# EAGLE design rn4020 (EAGLE 7.3.0)
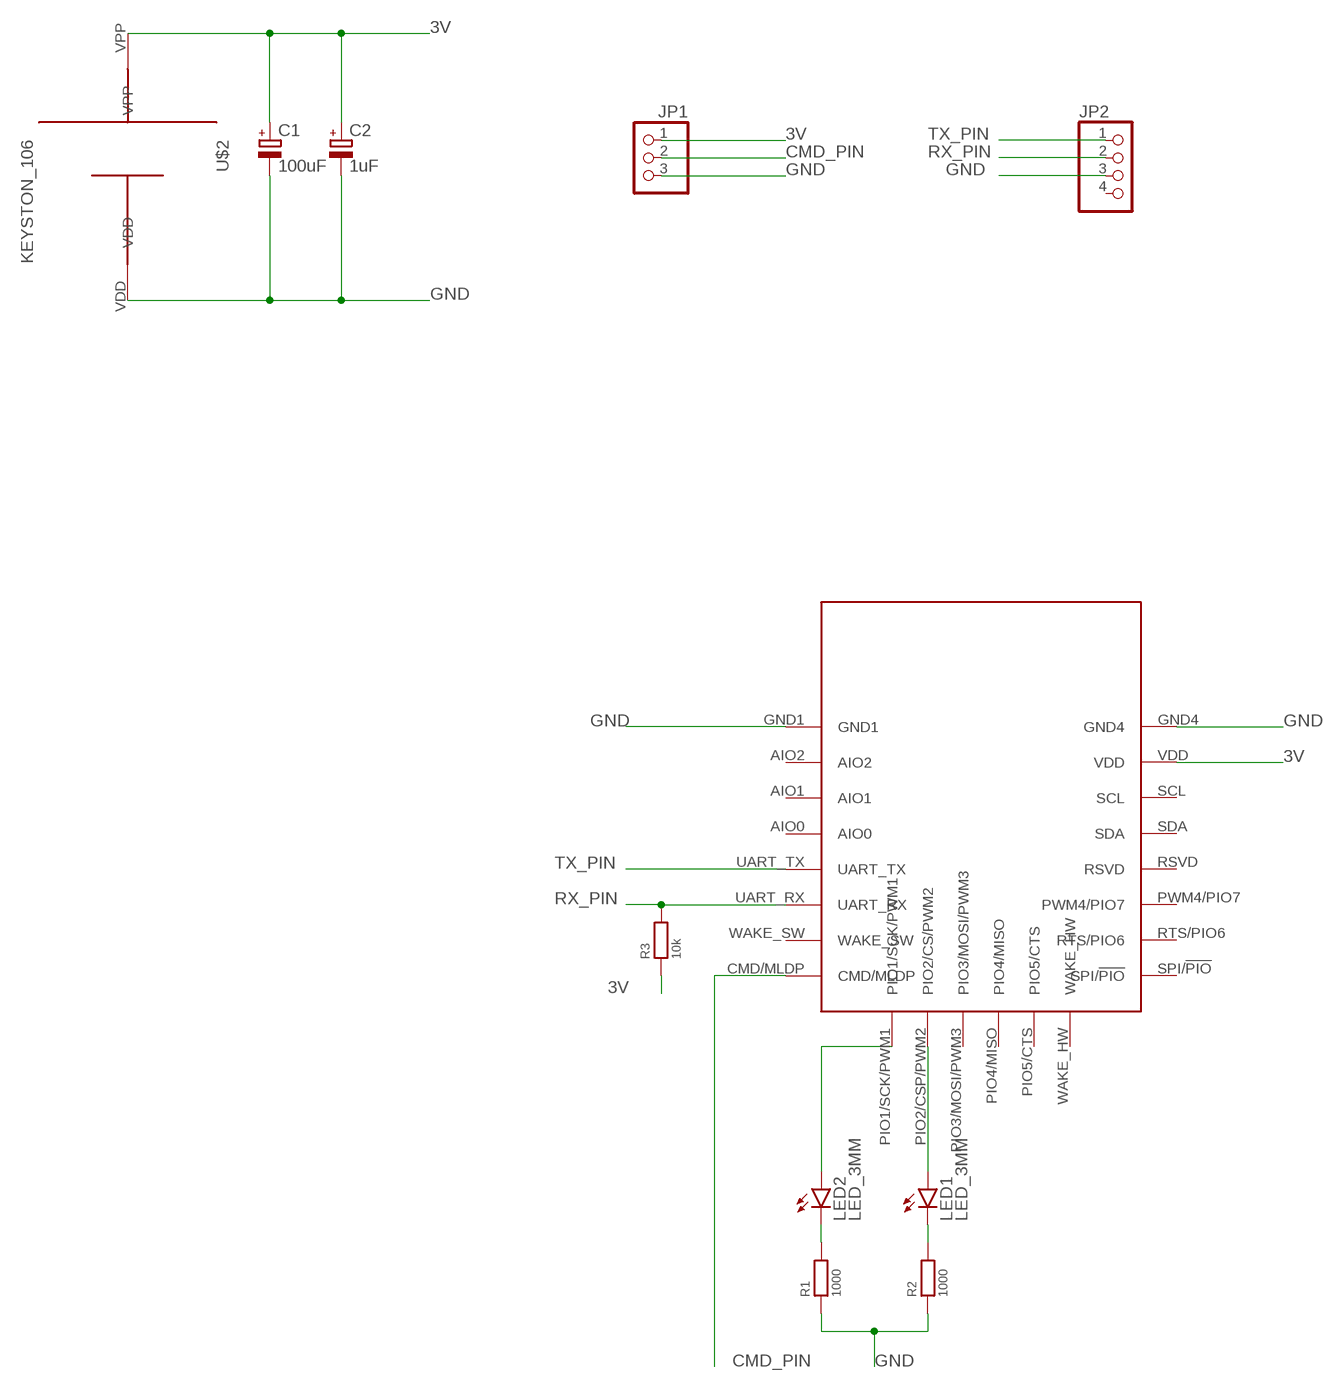
[diagram p0: schematic, sheet 1]

## Parts
C1  100uF  CPOL_DIAM5MM  [E2,5-6]
C2  1uF  CPOL_  [E2,5-7]
JP1  PINHD-1X3  [1X03]
JP2  PINHD-1X4  [1X04]
LED1  LED_3MM  [LED3MM]
LED2  LED_3MM  [LED3MM]
R1  1000  R_4PAS  [0207/10]
R2  1000  R_4PAS  [0207/10]
R3  10k  R_4PAS  [0207/10]
U$1  RN_4020  [RN4020]
U$2  KEYSTON_106  [CELL_HOLDER_PACKAGE]

## Nets
3V: C1.+ C2.+ JP1.1 R3.1 U$1.VDD U$2.VPP
CMD_PIN: JP1.2 U$1.CMD/MLDP
GND: C1.- C2.- JP1.3 JP2.3 R1.1 R2.1 U$1.GND1 U$1.GND4 U$2.VDD
N$1: LED2.A U$1.PIO1/SCK/PWM1
N$2: LED1.A U$1.PIO2/CSP/PWM2(PIO2/CS/PWM2)
N$3: LED1.K(C) R2.2
N$6: LED2.K(C) R1.2
RX_PIN: JP2.2 R3.2 U$1.UART_RX
TX_PIN: JP2.1 U$1.UART_TX
Unconnected: JP2.4 U$1.AIO0 U$1.AIO1 U$1.AIO2 U$1.PIO3/MOSI/PWM3 U$1.PIO4/MISO U$1.PIO5/CTS U$1.PWM4/PIO7 U$1.RSVD U$1.RTS/PIO6 U$1.SCL U$1.SDA U$1.SPI/!PIO U$1.WAKE_HW U$1.WAKE_SW

## Library data of the parts
C1 C2 = @Club_passif:CPOL_
JP1 = pinhead:PINHD-1X3: PIN HEADER
JP2 = pinhead:PINHD-1X4: PIN HEADER
LED1 LED2 = @Club_passif:LED_: LEDs, lumière quoi ! 1.8V < Vseuil < 2.0V environ
R1-R3 = @Club_passif:R_: Résistances standards
U$1 = rn4020:RN_4020
U$2 = keystone_106:KEYSTON_106: Support de pile Keystone 106 pour CR2032

## Board
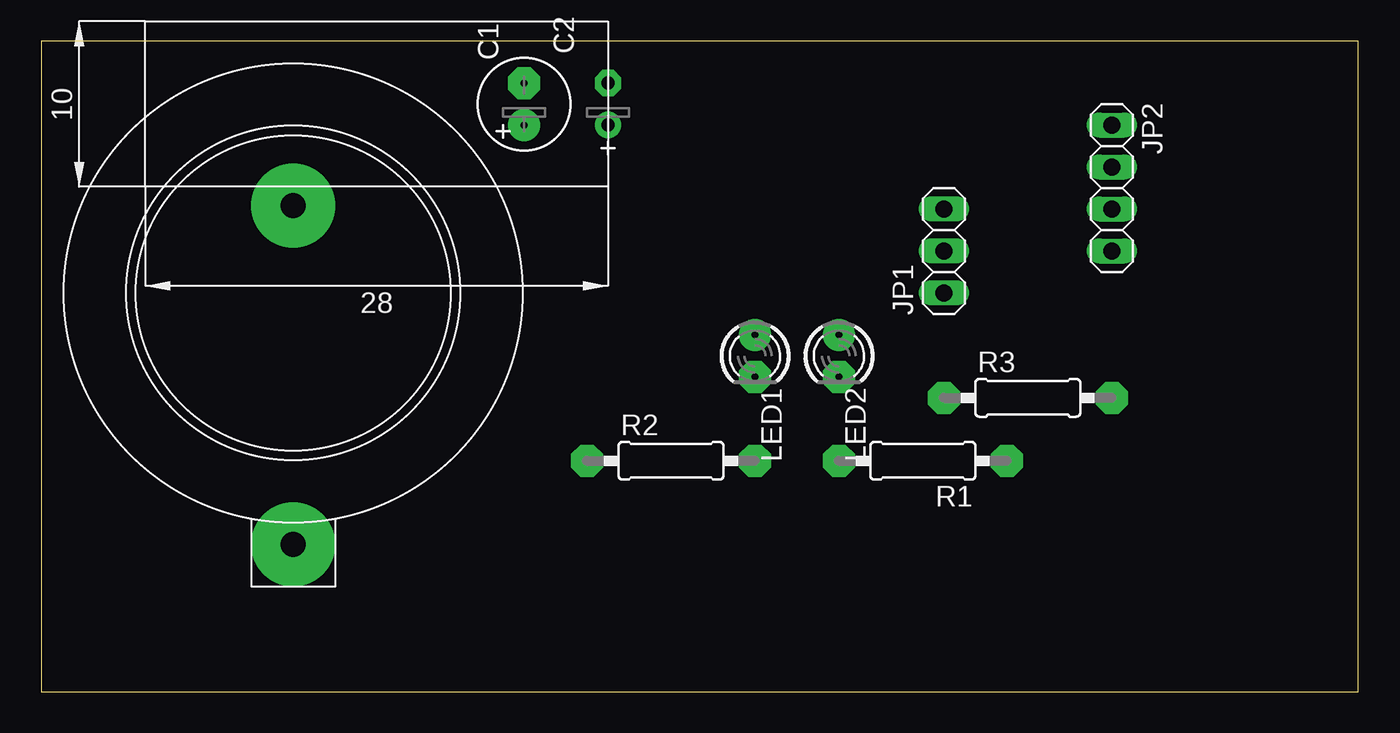
[diagram p1: board, top side]
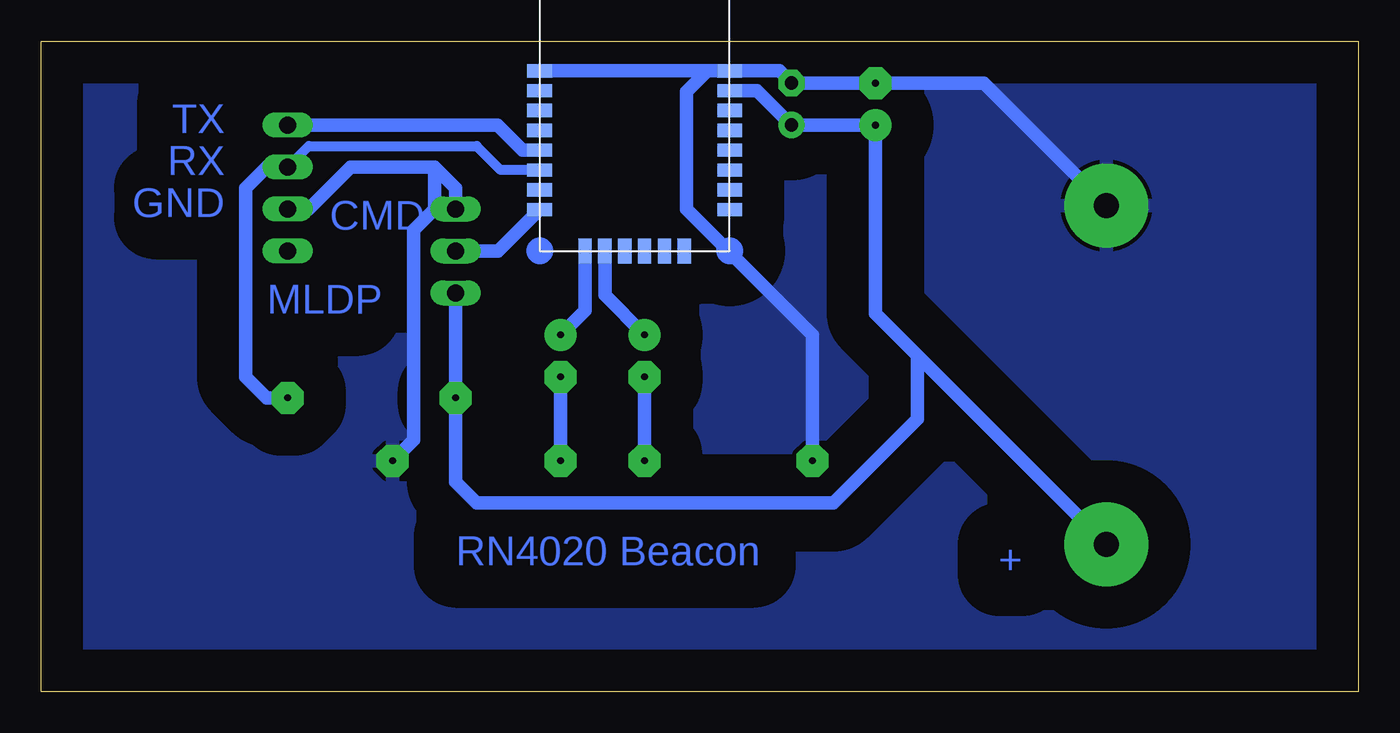
[diagram p2: board, bottom side, seen from below]

Size 79.68 x 39.36 mm. Coordinates in mm from the lower left corner, seen from the top.
Outline: 0,0 79.68,0 79.68,39.36 0,39.36 0,0
Copper layers (1*16): Top 0.035mm / dielectric 1.5mm / Bottom 0.035mm
Design rules "default": minimum track width 10mil, minimum drill 24mil, track to track 8mil, track to pad 8mil, pad to pad 8mil, via to via 8mil, smd to smd 8mil, copper to edge 40mil, drill to drill 8mil, minimum pad ring 10mil, minimum via ring 8mil, stop-mask expansion 4mil, vias tented up to drill 0mil, thermal gap 10mil

### Footprints (pad centres in the part's own frame; a part is rotated, then mirrored left to right if it is on the bottom)
E2,5-6 = drill 0.406 pad 1.93: + -1.27,0 | drill 0.406 pad 1.93 octagon: - 1.27,0
E2,5-7 = drill 0.813 pad 1.6: + -1.27,0 | drill 0.813 pad 1.6 octagon: - 1.27,0
1X03 = drill 1.016 long: 1 -2.54,0; 2 0,0; 3 2.54,0
1X04 = drill 1.016 long: 1 -3.81,0; 2 -1.27,0; 3 1.27,0; 4 3.81,0
LED3MM = drill 0.406 pad 1.93: A -1.27,0 | drill 0.406 pad 1.93 octagon: K 1.27,0
0207/10 = drill 0.406 pad 1.93 octagon: 1 -5.08,0; 2 5.08,0
RN4020 = smd 1.5 x 0.8: AIO0 0,7.3; AIO1 0,8.5; AIO2 0,9.7; CMD/MLDP 0,2.5; GND1 0,10.9; GND4 11.5,10.9; PWM4/PIO7 11.5,4.9; RSVD 11.5,6.1; RTS/PIO6 11.5,3.7; SCL 11.5,8.5; SDA 11.5,7.3; SPI/!PIO 11.5,2.5; UART_RX 0,4.9; UART_TX 0,6.1; VDD 11.5,9.7; WAKE_SW 0,3.7 | smd 0.8 x 1.5: PIO1/SCK/PWM1 2.75,0; PIO2/CSP/PWM2 3.95,0; PIO3/MOSI/PWM3 5.15,0; PIO4/MISO 6.35,0; PIO5/CTS 7.55,0; WAKE_HW 8.75,0
CELL_HOLDER_PACKAGE = drill 1.524 pad 5.08: VDD -5.283,0; VPP 15.215,0

### Placement (x,y rotation side)
C1  29.21,35.56 90 top
C2  34.29,35.56 90 top
JP1  54.61,26.67 90 top
JP2  64.77,30.48 270 top
LED1  43.18,20.32 270 top
LED2  48.26,20.32 270 top
R1  53.34,13.97 180 top
R2  38.1,13.97 0 top
R3  59.69,17.78 0 top
U$1  49.53,26.67 0 bottom
U$2  15.24,24.13 270 top

### Tracks (layer width: path | path; a pad name or v marks a point on that pad's centre or on a via)
3V
  Bottom 0.813: U$2.VPP 26.66,20.33 | 26.66,20.33 29.21,22.88 C1.+ C2.+ 36.37,36.37 U$1.VDD | R3.1 JP1.1 54.61,12.7 53.34,11.43 31.75,11.43 26.67,16.51 26.67,20.32 26.66,20.33
CMD_PIN
  Bottom 0.813: JP1.2 52.03,26.67 U$1.CMD/MLDP
GND
  Bottom 0.813: U$2.VDD 22.66,36.83 C1.- C2.- 35.03,37.57 U$1.GND4 39.37,37.57 | 39.37,37.57 U$1.GND1 | R2.1 33.02,21.59 40.64,29.21 40.64,36.3 39.37,37.57 | JP1.3 54.61,30.48 55.88,31.75 | 55.88,31.75 60.96,31.75 63.5,29.21 JP2.3 | 55.88,31.75 55.88,29.21 57.15,27.94 57.15,15.24 R1.1
  pour Bottom (isolate 2.54): 0,39.37 87.63,39.37 87.63,0 0,0
N$1
  Bottom 0.813: LED2.A 46.78,23.07 U$1.PIO1/SCK/PWM1
N$2
  Bottom 0.813: LED1.A 45.58,23.99 U$1.PIO2/CSP/PWM2
N$3
  Bottom 0.813: LED1.K R2.2
N$6
  Bottom 0.813: LED2.K R1.2
RX_PIN
  Bottom 0.61: JP2.2 63.5,33.02 53.34,33.02 51.89,31.57 U$1.UART_RX
  Bottom 0.813: R3.2 66.04,17.78 67.31,19.05 67.31,30.48 66.04,31.75 JP2.2
TX_PIN
  Bottom 0.813: U$1.UART_TX 50.55,32.77 52.07,34.29 JP2.1

### Text on the board
Bottom: TX | RX | GND | CMD | MLDP | + | RN4020 Beacon